# EAGLE schematic isoSP UART Test Board rev1 (EAGLE 9.6.2)
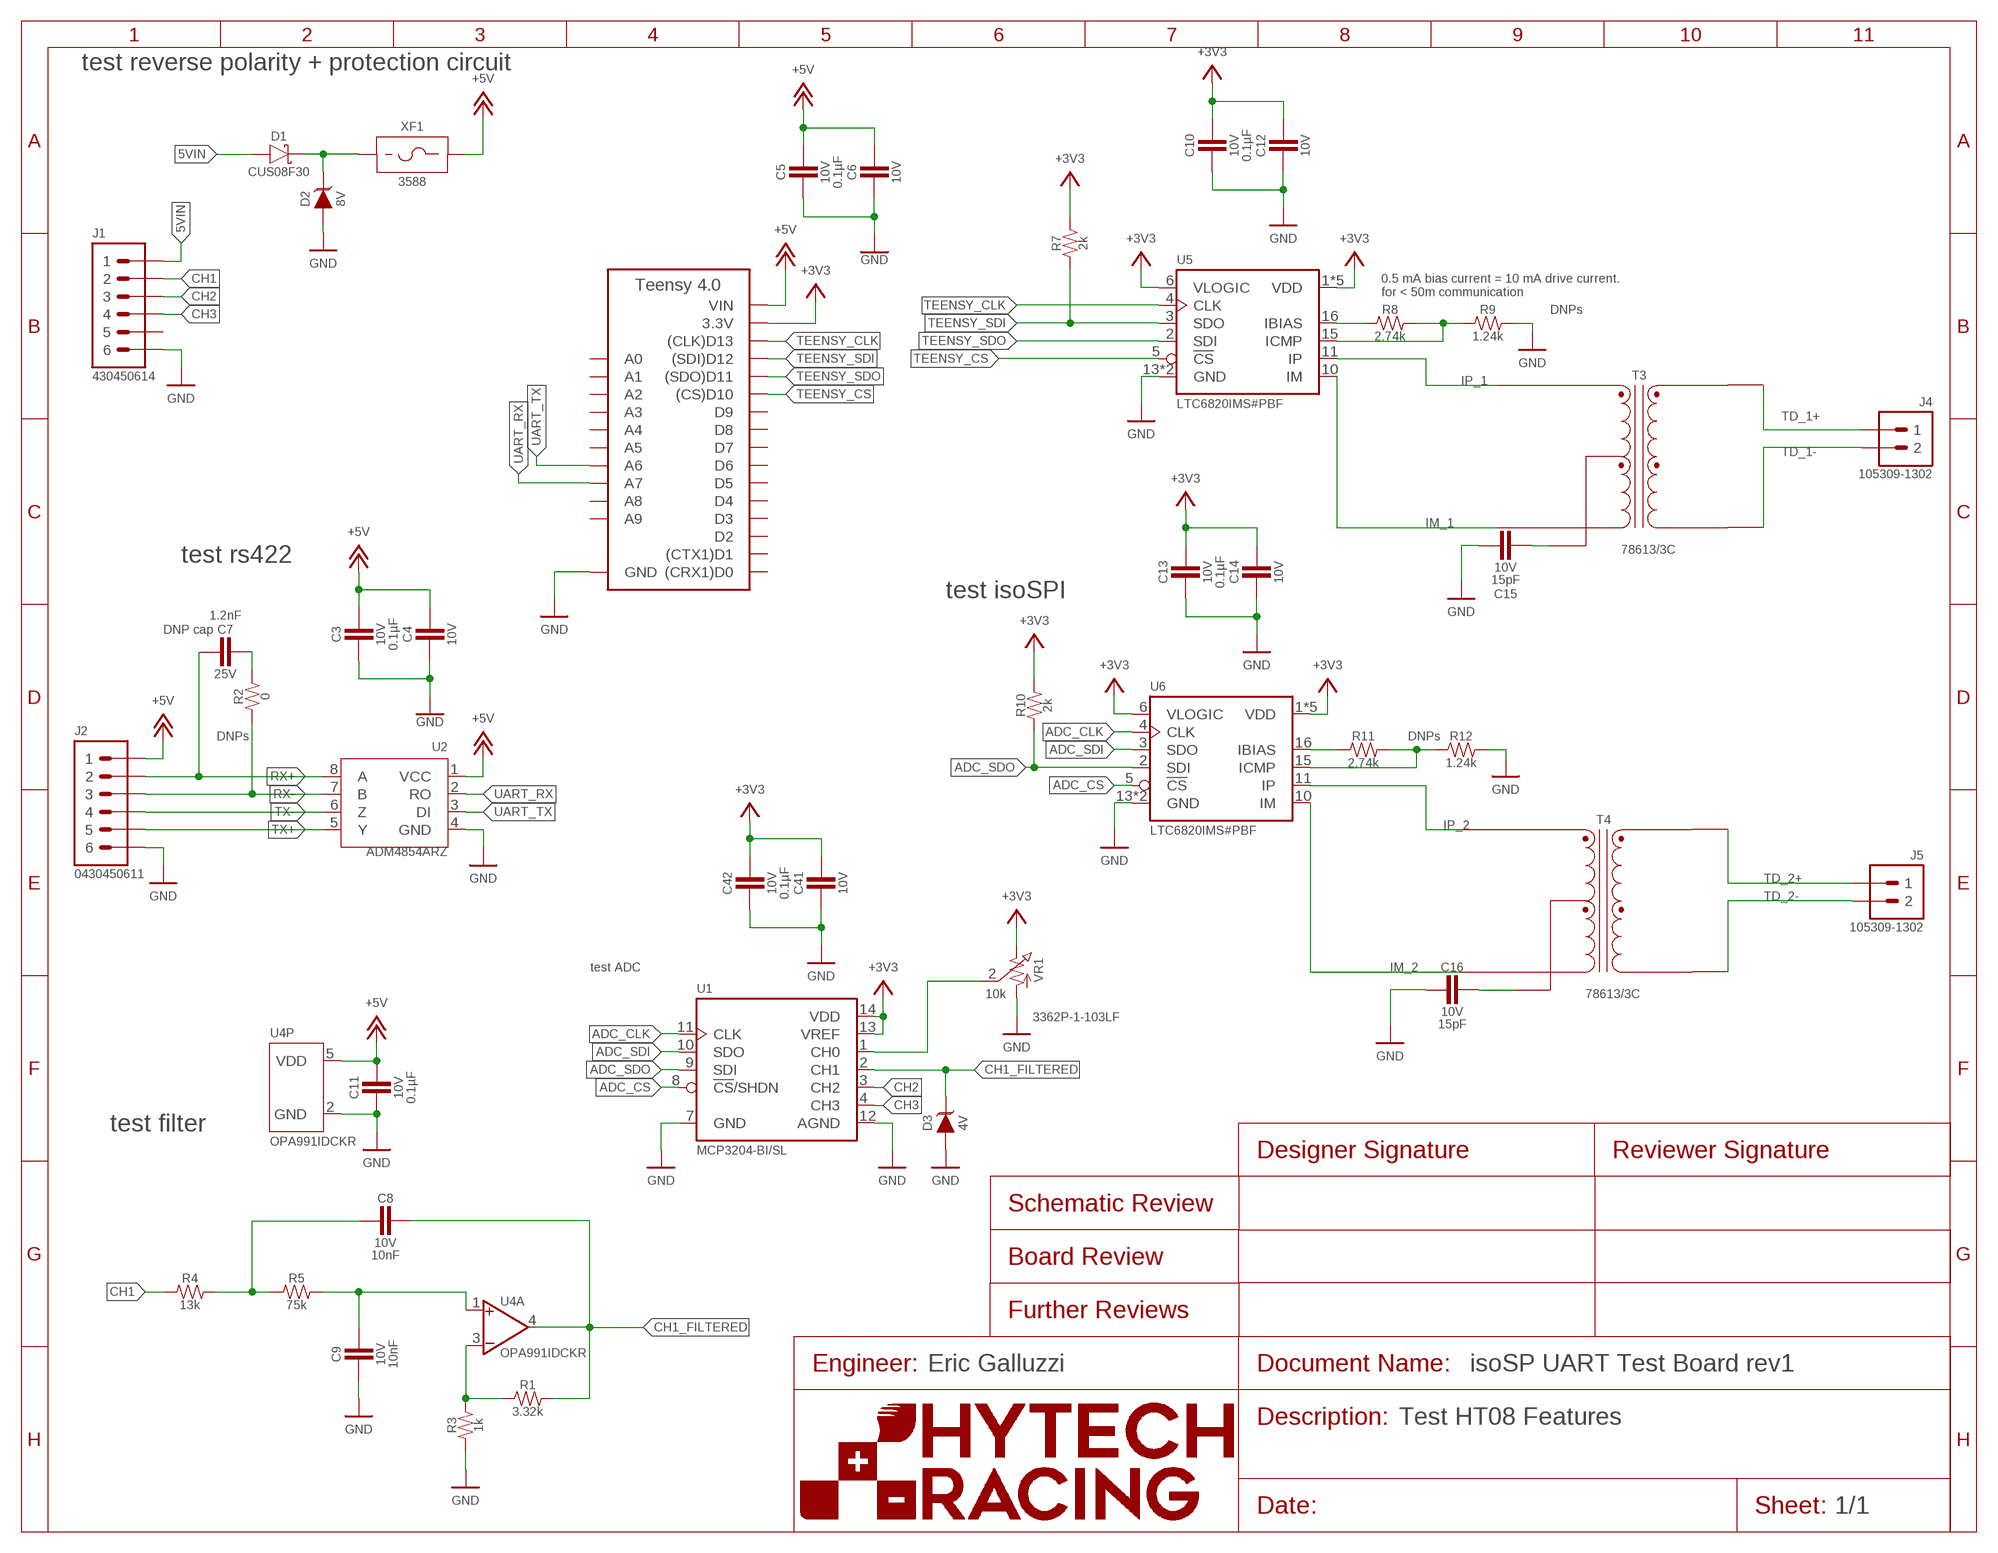
[diagram p0: schematic, sheet 1]
FRAME1 (FRAME): DESCRIPTION_1: Test HT08 Features; ENGINEER: Eric Galluzzi

## Parts
A1  TEENSY_4.0TH  [TEENSY_SHORT]
C3  CAPACITOR_0603_10V_0.1UF  [0603-CAP]
C4  CAPACITOR_0603_10V_1UF  [0603-CAP]
C5  CAPACITOR_0603_10V_0.1UF  [0603-CAP]
C6  CAPACITOR_0603_10V_1UF  [0603-CAP]
C7  CAPACITOR_0603_25V_1.2NF  [0603-CAP]
C8  CAPACITOR_0603_10V_10NF  [0603-CAP]
C9  CAPACITOR_0603_10V_10NF  [0603-CAP]
C10  CAPACITOR_0603_10V_0.1UF  [0603-CAP]
C11  CAPACITOR_0603_10V_0.1UF  [0603-CAP]
C12  CAPACITOR_0603_10V_1UF  [0603-CAP]
C13  CAPACITOR_0603_10V_0.1UF  [0603-CAP]
C14  CAPACITOR_0603_10V_1UF  [0603-CAP]
C15  CAPACITOR_0603_10V_15PF  [0603-CAP]
C16  CAPACITOR_0603_10V_15PF  [0603-CAP]
C41  CAPACITOR_0603_10V_1UF  [0603-CAP]
C42  CAPACITOR_0603_10V_0.1UF  [0603-CAP]
D1  SCHOTTKY_SOD323_30V  [SOD-323]
D2  TVS__8V  [SOT-23]
D3  TVS__4V  [SOT-23]
J1  CONNECTOR-6_μF_T_V_BLACK  [MOLEX_MICROFIT_PTH_VERTICAL_06_DUAL]
J2  CONNECTOR-6_μF_S_RA_  [MOLEX_MICROFIT_SMD_RIGHTANGLE_06_DUAL]
J4  CONNECTOR-2_MOLEX_NANOFIT_PTH_VERTICAL_02_BLACK  [MOLEX_NANOFIT_PTH_02]
J5  CONNECTOR-2_MOLEX_NANOFIT_PTH_VERTICAL_02_BLACK  [MOLEX_NANOFIT_PTH_02]
R1  RESISTOR_0603_3.32K  [0603-RES]
R2  RESISTOR_0603_0  [0603-RES]
R3  RESISTOR_0603_1K  [0603-RES]
R4  RESISTOR_0603_13K  [0603-RES]
R5  RESISTOR_0603_75K  [0603-RES]
R7  RESISTOR_0603_2K  [0603-RES]
R8  RESISTOR_0603_2.74K  [0603-RES]
R9  RESISTOR_0603_1.24K  [0603-RES]
R10  RESISTOR_0603_2K  [0603-RES]
R11  RESISTOR_0603_2.74K  [0603-RES]
R12  RESISTOR_0603_1.24K  [0603-RES]
T3  78613/3C  [78613/3C]
T4  78613/3C  [78613/3C]
U1  MCP3204  [SOIC-14]
U2  ADM4854ARZ  [SOIC-08(NARROW,0.15")]
U4  OPAMP_1_CHANNEL_OPA991  [SC-70-5]
U5  LTC6820  [MSOP-16]
U6  LTC6820  [MSOP-16]
VR1  RESISTOR_TRIMPOT_10K_3362P  [3362P]
XF1  FUSE_HOLDER_MINIBLADESMD  [3588]

## Nets
5VIN: D1.A J1.1
+3V3: A1.3.3V C10.1 C12.1 C13.1 C14.1 C41.1 C42.1 R7.2 R10.2 U1.13(VREF) U1.14(VDD) U5.1(VDD) U5.6(VLOGIC) U5.7(VDD) U5.8(VDD) U5.9(VDD) U5.12(VDD) U6.1(VDD) U6.6(VLOGIC) U6.7(VDD) U6.8(VDD) U6.9(VDD) U6.12(VDD) VR1.3
+5V: A1.VIN C3.1 C4.1 C5.1 C6.1 C11.1 J2.1 U2.1(VCC) U4.5(P:VDD) XF1.3 XF1.4
ADC_CLK: U1.11(CLK) U6.4(CLK)
ADC_CS: U1.8(!CS!/SHDN) U6.5(!CS)
ADC_SDI: U1.10(SDO) U6.3(SDO)
ADC_SDO: R10.1 U1.9(SDI) U6.2(SDI)
CH1: J1.2 R4.1
CH1_FILTERED: C8.1 D3.3(C) R1.2 U1.2(CH1) U4.4(A:VOUT)
CH2: J1.3 U1.3(CH2)
CH3: J1.4 U1.4(CH3)
GND: A1.AGND/GND(GND) A1.GND C3.2 C4.2 C5.2 C6.2 C9.2 C10.2 C11.2 C12.2 C13.2 C14.2 C15.2 C16.2 C41.2 C42.2 D2.1(A) D3.1(A) J1.6 J2.6 R3.1 R9.2 R12.2 U1.7(GND) U1.12(AGND) U2.4(GND) U4.2(P:GND) U5.13(GND) U5.14(GND) U6.13(GND) U6.14(GND) VR1.1
IM_1: T3.2(PRI_2) U5.10(IM)
IM_2: T4.2(PRI_2) U6.10(IM)
IP_1: T3.1(PRI_1) U5.11(IP)
IP_2: T4.1(PRI_1) U6.11(IP)
N$1: U1.1(CH0) VR1.2
N$2: C7.1 R2.2
N$3: D1.C D2.3(C) XF1.1 XF1.2
N$5: R1.1 R3.2 U4.3(A:VIN-)
N$7: R8.1 U5.16(IBIAS)
N$8: R8.2 R9.1 U5.15(ICMP)
N$9: R11.1 U6.16(IBIAS)
N$10: R11.2 R12.1 U6.15(ICMP)
N$11: C15.1 T3.3(PRI_CENTER_TAP)
N$12: C16.1 T4.3(PRI_CENTER_TAP)
N$13: C8.2 R4.2 R5.1
N$14: C9.1 R5.2 U4.1(A:VIN+)
RX+: C7.2 J2.2 U2.8(A)
RX-: J2.3 R2.1 U2.7(B)
TD_1+: J4.1 T3.6(SEC_2)
TD_1-: J4.2 T3.4(SEC_1)
TD_2+: J5.1 T4.6(SEC_2)
TD_2-: J5.2 T4.4(SEC_1)
TEENSY_CLK: A1.D13((CLK)D13) U5.4(CLK)
TEENSY_CS: A1.D10((CS)D10) U5.5(!CS)
TEENSY_SDI: A1.D12((SDI)D12) R7.1 U5.3(SDO)
TEENSY_SDO: A1.D11((SDO)D11) U5.2(SDI)
TX+: J2.5 U2.5(Y)
TX-: J2.4 U2.6(Z)
UART_RX: A1.D21(A7) U2.2(RO)
UART_TX: A1.D20(A6) U2.3(DI)
Unconnected: A1.D0((CRX1)D0) A1.D1((CTX1)D1) A1.D2 A1.D3 A1.D4 A1.D5 A1.D6 A1.D7 A1.D8 A1.D9 A1.D14(A0) A1.D15(A1) A1.D16(A2) A1.D17(A3) A1.D18(A4) A1.D19(A5) A1.D22(A8) A1.D23(A9) J1.5

## Notes on the sheet
- test reverse polarity + protection circuit
- 0.5 mA bias current = 10 mA drive current.
  for < 50m communication
- DNPs
- test rs422
- test isoSPI
- DNP cap
- DNPs | DNPs
- test ADC
- test filter

## Library data of the parts
A1 = HyTechDevices:TEENSY_4.0: Teensy 4.0 Datasheet <https://www.pjrc.com/store/teensy40.html> Requires ordering of: 2: 14 pin, 0.1" pitch female headers. Recommend Samtec SSM-114-L-SV for surface mount variant.; TEENSY: 4.0
C3 C5 C10 C11 C13 C42 = HyTechDevices:CAPACITOR_?_*: Capacitor, Non-Polarized VJ...1BC Series Datasheet <https://www.mouser.com/datasheet/2/427/vjw1bcbascomseries-1762447.pdf> Samsung Datasheet <https://www.mouser.com/datasheet/2/585/MLCC-1837944.pdf> Walsin Datasheet <https://www.mouser.com/datasheet/2/210/WTC_MLCC_General_Purpose-1534899.pdf> GRM188R61A226ME15D <https://www.mouser.com/datasheet/2/281/1/GRM188R61A226ME15_02A-1985787.pdf> GRM188R61E106MA73D <https://www.mouser.com/datasheet/2/281/1/GRM188R61E106MA73_01A-1985806.pdf> 885012006013 <https://www.mouser.com/datasheet/2/445/885012006013-1726946.pdf> 2220Y6300105KXTWS2 <https://www.mouser.com/datasheet/2/218/SMD_High_and_Std_StackiCap_P62-1825512.pdf> Yageo Class 2, X5R <https://www.mouser.com/datasheet/2/447/UPY_GPHC_X5R_4V_to_50V_26-1827097.pdf> TDK C Series <https://www.mouser.com/ProductDetail/TDK/C3216X5R1V226M160AC?qs=%2Fha2pyFadujbcx9jh7lYl%2F4NeMoXFhdc8AqVWNq4wW6M2y7zl6GzBuhgtI0ngznN> AVX Automotive MLCC <https://www.mouser.com/datasheet/2/40/AutoMLCC-777028.pdf> KEMET X7R Series <https://www.mouser.com/datasheet/2/212/KEM_C1002_X7R_SMD-1102033.pdf> Kyocera AVX <https://www.mouser.com/datasheet/2/40/C0GNP0_Dielectric-951274.pdf> GRM21BR61H <https://www.mouser.com/datasheet/2/281/1/GRM21BR61H106KE43_01A-1986884.pdf> C1812W104KDRACTU <https://www.mouser.com/datasheet/2/212/KEM_C1034_X7R_HV_ARC_SMD-1101730.pdf>; CAPACITANCE: 0.1µF; DKPN: 720-1688-1-ND; MANUFACTURER: Vishay Vitramon; MOPN: 77-VJ0603Y104JXQPBC; MPN: VJ0603Y104JXQPW1BC; TOLERANCE: 5%; VOLTAGE: 10V
C4 C6 C12 C14 C41 = HyTechDevices:CAPACITOR_?_*: Capacitor, Non-Polarized VJ...1BC Series Datasheet <https://www.mouser.com/datasheet/2/427/vjw1bcbascomseries-1762447.pdf> Samsung Datasheet <https://www.mouser.com/datasheet/2/585/MLCC-1837944.pdf> Walsin Datasheet <https://www.mouser.com/datasheet/2/210/WTC_MLCC_General_Purpose-1534899.pdf> GRM188R61A226ME15D <https://www.mouser.com/datasheet/2/281/1/GRM188R61A226ME15_02A-1985787.pdf> GRM188R61E106MA73D <https://www.mouser.com/datasheet/2/281/1/GRM188R61E106MA73_01A-1985806.pdf> 885012006013 <https://www.mouser.com/datasheet/2/445/885012006013-1726946.pdf> 2220Y6300105KXTWS2 <https://www.mouser.com/datasheet/2/218/SMD_High_and_Std_StackiCap_P62-1825512.pdf> Yageo Class 2, X5R <https://www.mouser.com/datasheet/2/447/UPY_GPHC_X5R_4V_to_50V_26-1827097.pdf> TDK C Series <https://www.mouser.com/ProductDetail/TDK/C3216X5R1V226M160AC?qs=%2Fha2pyFadujbcx9jh7lYl%2F4NeMoXFhdc8AqVWNq4wW6M2y7zl6GzBuhgtI0ngznN> AVX Automotive MLCC <https://www.mouser.com/datasheet/2/40/AutoMLCC-777028.pdf> KEMET X7R Series <https://www.mouser.com/datasheet/2/212/KEM_C1002_X7R_SMD-1102033.pdf> Kyocera AVX <https://www.mouser.com/datasheet/2/40/C0GNP0_Dielectric-951274.pdf> GRM21BR61H <https://www.mouser.com/datasheet/2/281/1/GRM21BR61H106KE43_01A-1986884.pdf> C1812W104KDRACTU <https://www.mouser.com/datasheet/2/212/KEM_C1034_X7R_HV_ARC_SMD-1101730.pdf>; CAPACITANCE: 1µF; DKPN: 311-1796-1-ND; MANUFACTURER: Yageo; MOPN: 603-CC603KRX7R6BB105; MPN: CC0603KRX7R6BB105; TOLERANCE: 10%; VOLTAGE: 10V
C7 = HyTechDevices:CAPACITOR_?_*: Capacitor, Non-Polarized VJ...1BC Series Datasheet <https://www.mouser.com/datasheet/2/427/vjw1bcbascomseries-1762447.pdf> Samsung Datasheet <https://www.mouser.com/datasheet/2/585/MLCC-1837944.pdf> Walsin Datasheet <https://www.mouser.com/datasheet/2/210/WTC_MLCC_General_Purpose-1534899.pdf> GRM188R61A226ME15D <https://www.mouser.com/datasheet/2/281/1/GRM188R61A226ME15_02A-1985787.pdf> GRM188R61E106MA73D <https://www.mouser.com/datasheet/2/281/1/GRM188R61E106MA73_01A-1985806.pdf> 885012006013 <https://www.mouser.com/datasheet/2/445/885012006013-1726946.pdf> 2220Y6300105KXTWS2 <https://www.mouser.com/datasheet/2/218/SMD_High_and_Std_StackiCap_P62-1825512.pdf> Yageo Class 2, X5R <https://www.mouser.com/datasheet/2/447/UPY_GPHC_X5R_4V_to_50V_26-1827097.pdf> TDK C Series <https://www.mouser.com/ProductDetail/TDK/C3216X5R1V226M160AC?qs=%2Fha2pyFadujbcx9jh7lYl%2F4NeMoXFhdc8AqVWNq4wW6M2y7zl6GzBuhgtI0ngznN> AVX Automotive MLCC <https://www.mouser.com/datasheet/2/40/AutoMLCC-777028.pdf> KEMET X7R Series <https://www.mouser.com/datasheet/2/212/KEM_C1002_X7R_SMD-1102033.pdf> Kyocera AVX <https://www.mouser.com/datasheet/2/40/C0GNP0_Dielectric-951274.pdf> GRM21BR61H <https://www.mouser.com/datasheet/2/281/1/GRM21BR61H106KE43_01A-1986884.pdf> C1812W104KDRACTU <https://www.mouser.com/datasheet/2/212/KEM_C1034_X7R_HV_ARC_SMD-1101730.pdf>; CAPACITANCE: 1.2nF; DKPN: 311-4079-2-ND; MANUFACTURER: YAGEO; MOPN: 603-CC603KRX7R8BB122; MPN: CC0603KRX7R8BB122; TOLERANCE: 10%; VOLTAGE: 25V
C8 C9 = HyTechDevices:CAPACITOR_?_*: Capacitor, Non-Polarized VJ...1BC Series Datasheet <https://www.mouser.com/datasheet/2/427/vjw1bcbascomseries-1762447.pdf> Samsung Datasheet <https://www.mouser.com/datasheet/2/585/MLCC-1837944.pdf> Walsin Datasheet <https://www.mouser.com/datasheet/2/210/WTC_MLCC_General_Purpose-1534899.pdf> GRM188R61A226ME15D <https://www.mouser.com/datasheet/2/281/1/GRM188R61A226ME15_02A-1985787.pdf> GRM188R61E106MA73D <https://www.mouser.com/datasheet/2/281/1/GRM188R61E106MA73_01A-1985806.pdf> 885012006013 <https://www.mouser.com/datasheet/2/445/885012006013-1726946.pdf> 2220Y6300105KXTWS2 <https://www.mouser.com/datasheet/2/218/SMD_High_and_Std_StackiCap_P62-1825512.pdf> Yageo Class 2, X5R <https://www.mouser.com/datasheet/2/447/UPY_GPHC_X5R_4V_to_50V_26-1827097.pdf> TDK C Series <https://www.mouser.com/ProductDetail/TDK/C3216X5R1V226M160AC?qs=%2Fha2pyFadujbcx9jh7lYl%2F4NeMoXFhdc8AqVWNq4wW6M2y7zl6GzBuhgtI0ngznN> AVX Automotive MLCC <https://www.mouser.com/datasheet/2/40/AutoMLCC-777028.pdf> KEMET X7R Series <https://www.mouser.com/datasheet/2/212/KEM_C1002_X7R_SMD-1102033.pdf> Kyocera AVX <https://www.mouser.com/datasheet/2/40/C0GNP0_Dielectric-951274.pdf> GRM21BR61H <https://www.mouser.com/datasheet/2/281/1/GRM21BR61H106KE43_01A-1986884.pdf> C1812W104KDRACTU <https://www.mouser.com/datasheet/2/212/KEM_C1034_X7R_HV_ARC_SMD-1101730.pdf>; CAPACITANCE: 10nF; DKPN: 311-4054-1-ND; MANUFACTURER: Yageo; MOPN: 603-CC603KRX7R6BB103; MPN: CC0603KRX7R6BB103; TOLERANCE: 10%; VOLTAGE: 10V
C15 C16 = HyTechDevices:CAPACITOR_?_*: Capacitor, Non-Polarized VJ...1BC Series Datasheet <https://www.mouser.com/datasheet/2/427/vjw1bcbascomseries-1762447.pdf> Samsung Datasheet <https://www.mouser.com/datasheet/2/585/MLCC-1837944.pdf> Walsin Datasheet <https://www.mouser.com/datasheet/2/210/WTC_MLCC_General_Purpose-1534899.pdf> GRM188R61A226ME15D <https://www.mouser.com/datasheet/2/281/1/GRM188R61A226ME15_02A-1985787.pdf> GRM188R61E106MA73D <https://www.mouser.com/datasheet/2/281/1/GRM188R61E106MA73_01A-1985806.pdf> 885012006013 <https://www.mouser.com/datasheet/2/445/885012006013-1726946.pdf> 2220Y6300105KXTWS2 <https://www.mouser.com/datasheet/2/218/SMD_High_and_Std_StackiCap_P62-1825512.pdf> Yageo Class 2, X5R <https://www.mouser.com/datasheet/2/447/UPY_GPHC_X5R_4V_to_50V_26-1827097.pdf> TDK C Series <https://www.mouser.com/ProductDetail/TDK/C3216X5R1V226M160AC?qs=%2Fha2pyFadujbcx9jh7lYl%2F4NeMoXFhdc8AqVWNq4wW6M2y7zl6GzBuhgtI0ngznN> AVX Automotive MLCC <https://www.mouser.com/datasheet/2/40/AutoMLCC-777028.pdf> KEMET X7R Series <https://www.mouser.com/datasheet/2/212/KEM_C1002_X7R_SMD-1102033.pdf> Kyocera AVX <https://www.mouser.com/datasheet/2/40/C0GNP0_Dielectric-951274.pdf> GRM21BR61H <https://www.mouser.com/datasheet/2/281/1/GRM21BR61H106KE43_01A-1986884.pdf> C1812W104KDRACTU <https://www.mouser.com/datasheet/2/212/KEM_C1034_X7R_HV_ARC_SMD-1101730.pdf>; CAPACITANCE: 15pF; DKPN: 720-VJ0603A150FXQPW1BCCT-ND; MANUFACTURER: Vishay Vitramon; MOPN: 77-VJ0603A150FXQPBC; MPN: VJ0603A150FXQPW1BC; TOLERANCE: 1%; VOLTAGE: 10V
D1 = HyTechDevices:SCHOTTKY_?_*: CUS08F30 Shottky Diode Datasheet <https://www.mouser.com/datasheet/2/408/CUS08F30_datasheet_en_20140414-1916097.pdf>; CURRENT: 0.8A; DKPN: CUS08F30H3FTR-ND; MANUFACTURER: Toshiba Semiconductor and Storage; MOPN: 757-CUS08F30H3F; MPN: CUS08F30; VOLTAGE: 30V
D2 = HyTechDevices:TVS_?_*: TVS Diode GSOT Datasheet <https://www.mouser.com/datasheet/2/427/gsot03-1767593.pdf>; DKPN: GSOT08-E3-08TR-ND; MANUFACTURER: Vishay General Semiconductor - Diodes Division; MOPN: 78-GSOT08-E3-08; MPN: GSOT08-E3-08; VOLTAGE: 8V
D3 = HyTechDevices:TVS_?_*: TVS Diode GSOT Datasheet <https://www.mouser.com/datasheet/2/427/gsot03-1767593.pdf>; DKPN: GSOT04-E3-08CT-ND; MANUFACTURER: Vishay General Semiconductor - Diodes Division; MOPN: 78-GSOT04-E3-08; MPN: GSOT04-E3-08; VOLTAGE: 4V
J1 = HyTechDevices:CONNECTOR-6_?_*: 6 Pin Connector; DKPN: WM1797-ND; MANUFACTURER: Molex; MOPN: 538-43045-0614; MPN: 430450614
J2 = HyTechDevices:CONNECTOR-6_?_*: 6 Pin Connector; DKPN: WM1833CT-ND; MANUFACTURER: Molex; MOPN: 538-43045-0611; MPN: 0430450611
J4 J5 = HyTechDevices:CONNECTOR-2_?_*: 2 Pin Connector; DKPN: WM15036-ND; MANUFACTURER: Molex; MOPN: 538-105309-1302; MPN: 105309-1302
R1 = HyTechDevices:RESISTOR_?_*: Resistor PWR163 Series <https://www.mouser.com/datasheet/2/54/pwr163-777985.pdf> AC Series <https://www.mouser.com/datasheet/2/447/Yageo_PYu_AC_51_RoHS_L_7_1714230-1874691.pdf> PU Series <https://www.mouser.com/datasheet/2/447/PYu-PU_51_RoHS_L_6-1504619.pdf> ERA Series <https://www.mouser.com/datasheet/2/315/AOA0000C307-1149632.pdf> PWR263 Series <https://www.mouser.com/datasheet/2/54/pwr263s_35-778069.pdf> KTR Series <https://www.mouser.com/datasheet/2/348/ROHM_S_A0011075115_1-2563276.pdf> RC Series <https://www.mouser.com/datasheet/2/447/Yageo_03_18_2021_PYu_RC_Group_51_RoHS_L_11-2199992.pdf> ERJ PB3, PB6 Series <https://www.mouser.com/datasheet/2/315/AOA0000C328-1530132.pdf> ERJ PA2, P03, PA3, P06, P08, P14 Series <https://www.mouser.com/datasheet/2/315/AOA0000C331-1141874.pdf> B20 Series <https://www.ohmite.com/assets/docs/res_200.pdf?r=false> TE Connectivity/Holsworthy RN73 Series <https://www.mouser.com/datasheet/2/418/4/NG_DS_1773270_M-604713.pdf> Vishay Dale D/CRCW e3 <https://www.mouser.com/datasheet/2/427/dcrcwe3-1762152.pdf> Ohmite B20 <https://www.ohmite.com/assets/docs/res_200.pdf?r=false>; DKPN: YAG1651TR-ND; MANUFACTURER: Yageo; MOPN: 603-RT0603BRD073K32L; MPN: RT0603BRD073K32L; POWER: 0.1W; RESISTANCE: 3.32k; TOLERANCE: 0.1%; VOLTAGE_CONTINUOUS: 18.22V; VOLTAGE_MAX: 75V
R2 = HyTechDevices:RESISTOR_?_*: Resistor PWR163 Series <https://www.mouser.com/datasheet/2/54/pwr163-777985.pdf> AC Series <https://www.mouser.com/datasheet/2/447/Yageo_PYu_AC_51_RoHS_L_7_1714230-1874691.pdf> PU Series <https://www.mouser.com/datasheet/2/447/PYu-PU_51_RoHS_L_6-1504619.pdf> ERA Series <https://www.mouser.com/datasheet/2/315/AOA0000C307-1149632.pdf> PWR263 Series <https://www.mouser.com/datasheet/2/54/pwr263s_35-778069.pdf> KTR Series <https://www.mouser.com/datasheet/2/348/ROHM_S_A0011075115_1-2563276.pdf> RC Series <https://www.mouser.com/datasheet/2/447/Yageo_03_18_2021_PYu_RC_Group_51_RoHS_L_11-2199992.pdf> ERJ PB3, PB6 Series <https://www.mouser.com/datasheet/2/315/AOA0000C328-1530132.pdf> ERJ PA2, P03, PA3, P06, P08, P14 Series <https://www.mouser.com/datasheet/2/315/AOA0000C331-1141874.pdf> B20 Series <https://www.ohmite.com/assets/docs/res_200.pdf?r=false> TE Connectivity/Holsworthy RN73 Series <https://www.mouser.com/datasheet/2/418/4/NG_DS_1773270_M-604713.pdf> Vishay Dale D/CRCW e3 <https://www.mouser.com/datasheet/2/427/dcrcwe3-1762152.pdf> Ohmite B20 <https://www.ohmite.com/assets/docs/res_200.pdf?r=false>; DKPN: 311-0.0HRCT-ND; MANUFACTURER: Yageo; MOPN: 603-RC0603FR-070RL; MPN: RC0603FR-070RL; POWER: 0.1W; RESISTANCE: 0; TOLERANCE: 1%; VOLTAGE_CONTINUOUS: 75V; VOLTAGE_MAX: 75V
R3 = HyTechDevices:RESISTOR_?_*: Resistor PWR163 Series <https://www.mouser.com/datasheet/2/54/pwr163-777985.pdf> AC Series <https://www.mouser.com/datasheet/2/447/Yageo_PYu_AC_51_RoHS_L_7_1714230-1874691.pdf> PU Series <https://www.mouser.com/datasheet/2/447/PYu-PU_51_RoHS_L_6-1504619.pdf> ERA Series <https://www.mouser.com/datasheet/2/315/AOA0000C307-1149632.pdf> PWR263 Series <https://www.mouser.com/datasheet/2/54/pwr263s_35-778069.pdf> KTR Series <https://www.mouser.com/datasheet/2/348/ROHM_S_A0011075115_1-2563276.pdf> RC Series <https://www.mouser.com/datasheet/2/447/Yageo_03_18_2021_PYu_RC_Group_51_RoHS_L_11-2199992.pdf> ERJ PB3, PB6 Series <https://www.mouser.com/datasheet/2/315/AOA0000C328-1530132.pdf> ERJ PA2, P03, PA3, P06, P08, P14 Series <https://www.mouser.com/datasheet/2/315/AOA0000C331-1141874.pdf> B20 Series <https://www.ohmite.com/assets/docs/res_200.pdf?r=false> TE Connectivity/Holsworthy RN73 Series <https://www.mouser.com/datasheet/2/418/4/NG_DS_1773270_M-604713.pdf> Vishay Dale D/CRCW e3 <https://www.mouser.com/datasheet/2/427/dcrcwe3-1762152.pdf> Ohmite B20 <https://www.ohmite.com/assets/docs/res_200.pdf?r=false>; DKPN: 1712-CPF-A-0603B1K0ETR-ND; MANUFACTURER: TE Connectivity Passive Product; MOPN: 279-CPF-A-0603B1K0E; MPN: CPF-A-0603B1K0E; POWER: 0.0625W; RESISTANCE: 1k; TOLERANCE: 0.1%; VOLTAGE_CONTINUOUS: 7.9V; VOLTAGE_MAX: 50V
R4 = HyTechDevices:RESISTOR_?_*: Resistor PWR163 Series <https://www.mouser.com/datasheet/2/54/pwr163-777985.pdf> AC Series <https://www.mouser.com/datasheet/2/447/Yageo_PYu_AC_51_RoHS_L_7_1714230-1874691.pdf> PU Series <https://www.mouser.com/datasheet/2/447/PYu-PU_51_RoHS_L_6-1504619.pdf> ERA Series <https://www.mouser.com/datasheet/2/315/AOA0000C307-1149632.pdf> PWR263 Series <https://www.mouser.com/datasheet/2/54/pwr263s_35-778069.pdf> KTR Series <https://www.mouser.com/datasheet/2/348/ROHM_S_A0011075115_1-2563276.pdf> RC Series <https://www.mouser.com/datasheet/2/447/Yageo_03_18_2021_PYu_RC_Group_51_RoHS_L_11-2199992.pdf> ERJ PB3, PB6 Series <https://www.mouser.com/datasheet/2/315/AOA0000C328-1530132.pdf> ERJ PA2, P03, PA3, P06, P08, P14 Series <https://www.mouser.com/datasheet/2/315/AOA0000C331-1141874.pdf> B20 Series <https://www.ohmite.com/assets/docs/res_200.pdf?r=false> TE Connectivity/Holsworthy RN73 Series <https://www.mouser.com/datasheet/2/418/4/NG_DS_1773270_M-604713.pdf> Vishay Dale D/CRCW e3 <https://www.mouser.com/datasheet/2/427/dcrcwe3-1762152.pdf> Ohmite B20 <https://www.ohmite.com/assets/docs/res_200.pdf?r=false>; DKPN: P13KBECT-ND; MANUFACTURER: Panasonic Electronic Components; MOPN: 667-ERA-3ARW133V; MPN: ERA-3ARW133V; POWER: 0.1W; RESISTANCE: 13k; TOLERANCE: 0.05%; VOLTAGE_CONTINUOUS: 75V; VOLTAGE_MAX: 150V
R5 = HyTechDevices:RESISTOR_?_*: Resistor PWR163 Series <https://www.mouser.com/datasheet/2/54/pwr163-777985.pdf> AC Series <https://www.mouser.com/datasheet/2/447/Yageo_PYu_AC_51_RoHS_L_7_1714230-1874691.pdf> PU Series <https://www.mouser.com/datasheet/2/447/PYu-PU_51_RoHS_L_6-1504619.pdf> ERA Series <https://www.mouser.com/datasheet/2/315/AOA0000C307-1149632.pdf> PWR263 Series <https://www.mouser.com/datasheet/2/54/pwr263s_35-778069.pdf> KTR Series <https://www.mouser.com/datasheet/2/348/ROHM_S_A0011075115_1-2563276.pdf> RC Series <https://www.mouser.com/datasheet/2/447/Yageo_03_18_2021_PYu_RC_Group_51_RoHS_L_11-2199992.pdf> ERJ PB3, PB6 Series <https://www.mouser.com/datasheet/2/315/AOA0000C328-1530132.pdf> ERJ PA2, P03, PA3, P06, P08, P14 Series <https://www.mouser.com/datasheet/2/315/AOA0000C331-1141874.pdf> B20 Series <https://www.ohmite.com/assets/docs/res_200.pdf?r=false> TE Connectivity/Holsworthy RN73 Series <https://www.mouser.com/datasheet/2/418/4/NG_DS_1773270_M-604713.pdf> Vishay Dale D/CRCW e3 <https://www.mouser.com/datasheet/2/427/dcrcwe3-1762152.pdf> Ohmite B20 <https://www.ohmite.com/assets/docs/res_200.pdf?r=false>; DKPN: RT0603BRE0775KL-ND; MANUFACTURER: Yageo; MOPN: 603-RT0603BRE0775KL; MPN: RT0603BRE0775KL; POWER: 0.1W; RESISTANCE: 75k; TOLERANCE: 0.1%; VOLTAGE_CONTINUOUS: 75V; VOLTAGE_MAX: 75V
R7 R10 = HyTechDevices:RESISTOR_?_*: Resistor PWR163 Series <https://www.mouser.com/datasheet/2/54/pwr163-777985.pdf> AC Series <https://www.mouser.com/datasheet/2/447/Yageo_PYu_AC_51_RoHS_L_7_1714230-1874691.pdf> PU Series <https://www.mouser.com/datasheet/2/447/PYu-PU_51_RoHS_L_6-1504619.pdf> ERA Series <https://www.mouser.com/datasheet/2/315/AOA0000C307-1149632.pdf> PWR263 Series <https://www.mouser.com/datasheet/2/54/pwr263s_35-778069.pdf> KTR Series <https://www.mouser.com/datasheet/2/348/ROHM_S_A0011075115_1-2563276.pdf> RC Series <https://www.mouser.com/datasheet/2/447/Yageo_03_18_2021_PYu_RC_Group_51_RoHS_L_11-2199992.pdf> ERJ PB3, PB6 Series <https://www.mouser.com/datasheet/2/315/AOA0000C328-1530132.pdf> ERJ PA2, P03, PA3, P06, P08, P14 Series <https://www.mouser.com/datasheet/2/315/AOA0000C331-1141874.pdf> B20 Series <https://www.ohmite.com/assets/docs/res_200.pdf?r=false> TE Connectivity/Holsworthy RN73 Series <https://www.mouser.com/datasheet/2/418/4/NG_DS_1773270_M-604713.pdf> Vishay Dale D/CRCW e3 <https://www.mouser.com/datasheet/2/427/dcrcwe3-1762152.pdf> Ohmite B20 <https://www.ohmite.com/assets/docs/res_200.pdf?r=false>; DKPN: 10-ERJ-UP3F2001VTR-ND; MANUFACTURER: Panasonic Electronic Components; MOPN: 667-ERJ-UP3F2001V; MPN: ERJ-UP3F2001V; POWER: 0.25W; RESISTANCE: 2k; TOLERANCE: 1%; VOLTAGE_CONTINUOUS: 22.36V; VOLTAGE_MAX: 150V
R8 R11 = HyTechDevices:RESISTOR_?_*: Resistor PWR163 Series <https://www.mouser.com/datasheet/2/54/pwr163-777985.pdf> AC Series <https://www.mouser.com/datasheet/2/447/Yageo_PYu_AC_51_RoHS_L_7_1714230-1874691.pdf> PU Series <https://www.mouser.com/datasheet/2/447/PYu-PU_51_RoHS_L_6-1504619.pdf> ERA Series <https://www.mouser.com/datasheet/2/315/AOA0000C307-1149632.pdf> PWR263 Series <https://www.mouser.com/datasheet/2/54/pwr263s_35-778069.pdf> KTR Series <https://www.mouser.com/datasheet/2/348/ROHM_S_A0011075115_1-2563276.pdf> RC Series <https://www.mouser.com/datasheet/2/447/Yageo_03_18_2021_PYu_RC_Group_51_RoHS_L_11-2199992.pdf> ERJ PB3, PB6 Series <https://www.mouser.com/datasheet/2/315/AOA0000C328-1530132.pdf> ERJ PA2, P03, PA3, P06, P08, P14 Series <https://www.mouser.com/datasheet/2/315/AOA0000C331-1141874.pdf> B20 Series <https://www.ohmite.com/assets/docs/res_200.pdf?r=false> TE Connectivity/Holsworthy RN73 Series <https://www.mouser.com/datasheet/2/418/4/NG_DS_1773270_M-604713.pdf> Vishay Dale D/CRCW e3 <https://www.mouser.com/datasheet/2/427/dcrcwe3-1762152.pdf> Ohmite B20 <https://www.ohmite.com/assets/docs/res_200.pdf?r=false>; DKPN: P20020CT-ND; MANUFACTURER: Panasonic Electronic Components; MOPN: 667-ERJ-PB3B2741V; MPN: ERJ-PB3B2741V; POWER: 0.2W; RESISTANCE: 2.74k; TOLERANCE: 0.1%; VOLTAGE_CONTINUOUS: 23.41V; VOLTAGE_MAX: 150V
R9 R12 = HyTechDevices:RESISTOR_?_*: Resistor PWR163 Series <https://www.mouser.com/datasheet/2/54/pwr163-777985.pdf> AC Series <https://www.mouser.com/datasheet/2/447/Yageo_PYu_AC_51_RoHS_L_7_1714230-1874691.pdf> PU Series <https://www.mouser.com/datasheet/2/447/PYu-PU_51_RoHS_L_6-1504619.pdf> ERA Series <https://www.mouser.com/datasheet/2/315/AOA0000C307-1149632.pdf> PWR263 Series <https://www.mouser.com/datasheet/2/54/pwr263s_35-778069.pdf> KTR Series <https://www.mouser.com/datasheet/2/348/ROHM_S_A0011075115_1-2563276.pdf> RC Series <https://www.mouser.com/datasheet/2/447/Yageo_03_18_2021_PYu_RC_Group_51_RoHS_L_11-2199992.pdf> ERJ PB3, PB6 Series <https://www.mouser.com/datasheet/2/315/AOA0000C328-1530132.pdf> ERJ PA2, P03, PA3, P06, P08, P14 Series <https://www.mouser.com/datasheet/2/315/AOA0000C331-1141874.pdf> B20 Series <https://www.ohmite.com/assets/docs/res_200.pdf?r=false> TE Connectivity/Holsworthy RN73 Series <https://www.mouser.com/datasheet/2/418/4/NG_DS_1773270_M-604713.pdf> Vishay Dale D/CRCW e3 <https://www.mouser.com/datasheet/2/427/dcrcwe3-1762152.pdf> Ohmite B20 <https://www.ohmite.com/assets/docs/res_200.pdf?r=false>; DKPN: 311-1.24KHRCT-ND; MANUFACTURER: Yageo; MOPN: 603-RC0603FR-071K24L; MPN: RC0603FR-071K24L; POWER: 0.1W; RESISTANCE: 1.24k; TOLERANCE: 1%; VOLTAGE_CONTINUOUS: 11.14V; VOLTAGE_MAX: 75V
T3 T4 = HyTechDevices:78613/3C: Murata 78613/3C Pulse Transformers 1CT:1 200 UH Datasheet <https://www.murata.com/products/productdata/8816046047262/kmp-786.pdf>; DKPN: 811-3726-ND; MANUFACTURER: Murata Power Solutions; MOPN: 580-786133C; MPN: 78613/3C
U1 = HyTechDevices:MCP3204: MCP3204 4-Channel ADC Datasheet <https://www.mouser.com/datasheet/2/268/21298c-68472.pdf>; DKPN: MCP3204-BI/SL-ND; MANUFACTURER: Microchip Technology; MOPN: 579-MCP3204-BI/SL; MPN: MCP3204-BI/SL
U2 = HyTechDevices:ADM4854ARZ: ADM4854ARZ RS422 Transreceiver Datasheet <https://www.analog.com/media/en/technical-documentation/data-sheets/ADM4850_4851_4852_4853_4854_4855_4856_4857.pdf>; DKPN: 505-ADM4854ARZ-ND; MANUFACTURER: Analog Devices Inc.; MOPN: 584-ADM4854ARZ; MPN: ADM4854ARZ
U4 = HyTechDevices:OPAMP_1_CHANNEL_*: Op-Amp 1 Channel OPA991 Datasheet <https://www.ti.com/lit/ds/symlink/opa991.pdf?ts=1615503614502> Note: OPA991 is also a comparator; DKPN: 296-OPA991IDCKRCT-ND; MANUFACTURER: Texas Instruments; MOPN: 595-OPA991IDCKR; MPN: OPA991IDCKR
U5 U6 = HyTechDevices:LTC6820: LTC6820 isoSPI Isolated Communications Interface Datasheet <mouser.com/datasheet/2/609/LTC6820-1601976.pdf>; MANUFACTURER: Analog Devices; MPN: LTC6820IMS#PBF
VR1 = HyTechDevices:RESISTOR_TRIMPOT_*_?: Variable Resistor Bourns 3362P Datasheet <https://www.mouser.com/datasheet/2/54/3362-776956.pdf>; DKPN: 3362P-103LF-ND; MANUFACTURER: Bourns Inc.; MOPN: 652-3362P-1-103LF; MPN: 3362P-1-103LF; POWER: 0.5W; RESISTANCE: 10k; TOLERANCE: 10%; VOLTAGE: 70.711V
XF1 = HyTechDevices:FUSE_HOLDER_*: Fuse Holder All PNs for the holder; if Miniblade Fuses <https://www.littelfuse.com/media?resourcetype=datasheets&itemid=0f5f58cb-559e-494b-8d53-723f30445ae5&filename=littelfuse-mini-datasheet> needed, order separately. Mini-Blade PTH <https://www.mouser.com/datasheet/2/215/3568-742601.pdf> Mini-Blade SMD <https://www.mouser.com/datasheet/2/215/588-744913.pdf> Littelfuse 122 Fuse Holder and Fuse Fuse <https://www.littelfuse.com/~/media/electronics/datasheets/fuses/littelfuse_fuse_508_datasheet.pdf.pdf> Fuse Holder <https://www.littelfuse.com/~/media/electronics/datasheets/fuse_clips/littelfuse_fuse_clip_102_122_datasheet.pdf.pdf>; DKPN: 36-3588-ND; FUSE_TYPE: MINI 297; MANUFACTURER: Keystone Electronics; MOPN: 534-3588; MPN: 3588